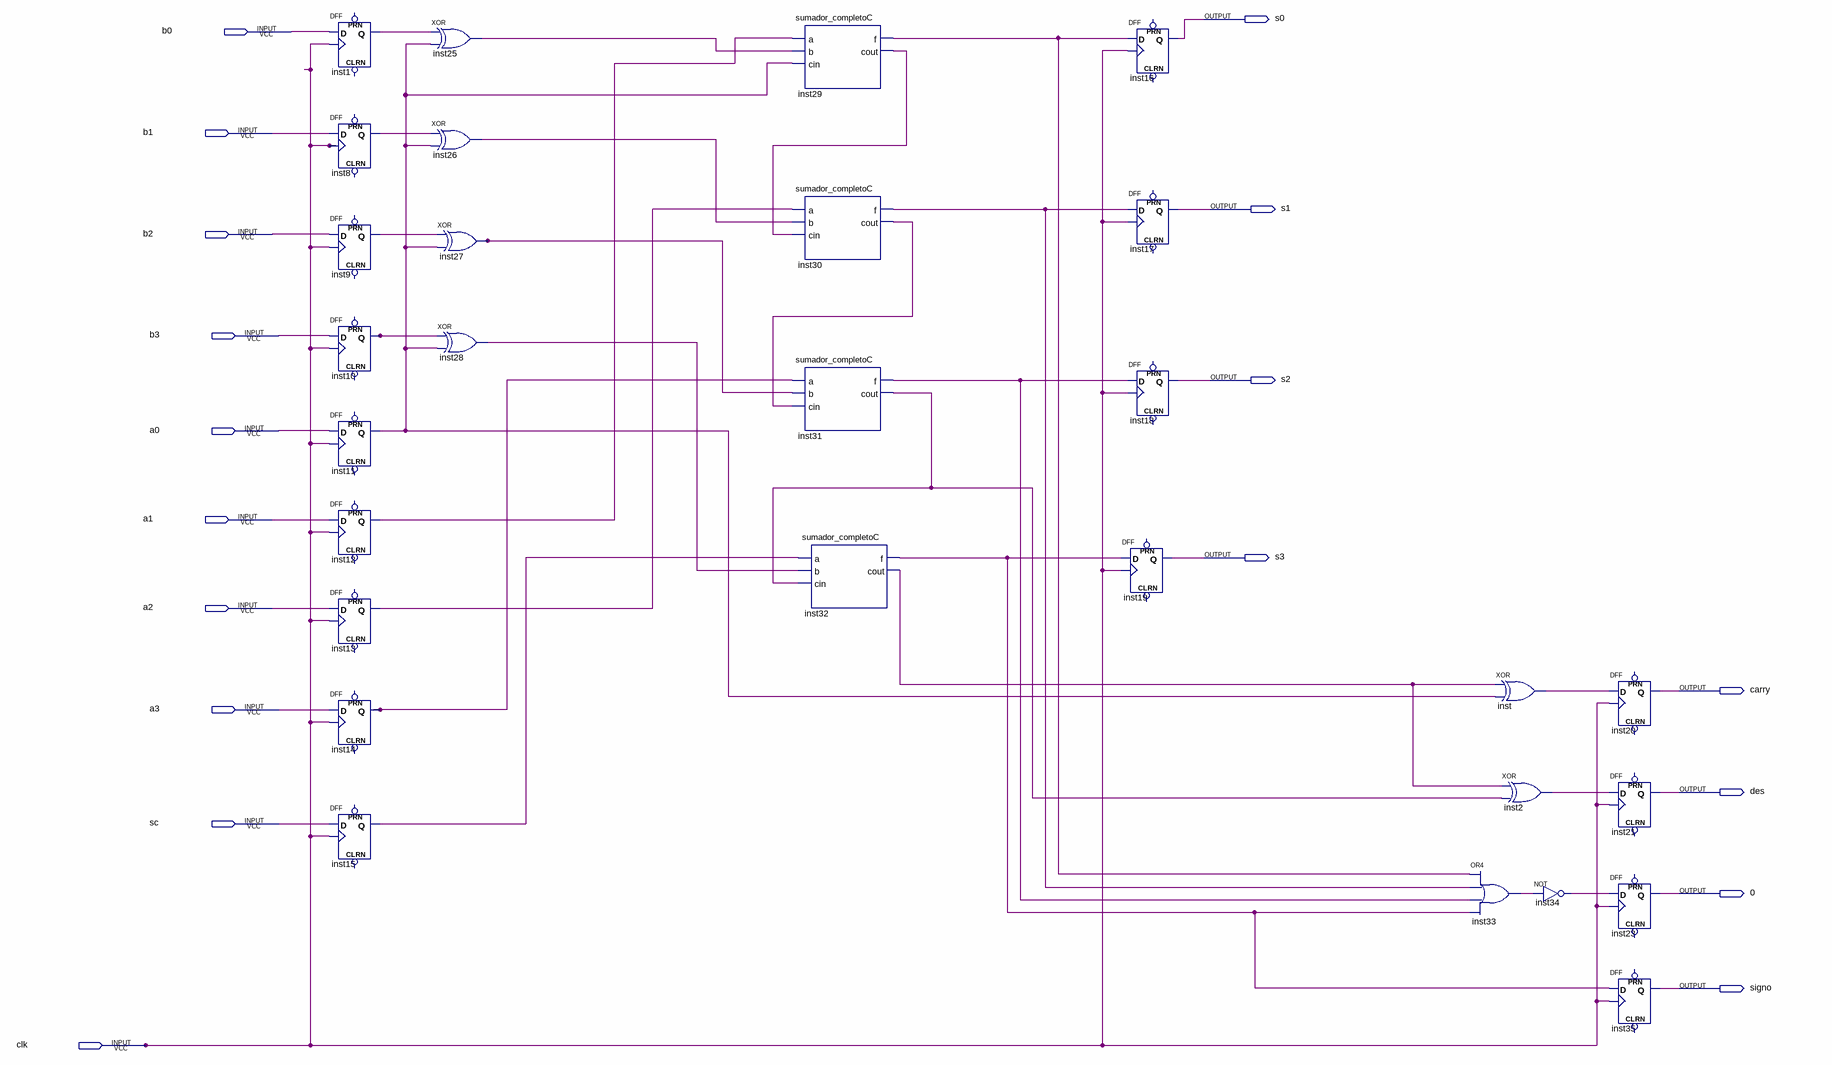
[diagram p0: schematic sheet]
// Quartus schematic sumador_completo.bdf as structural Verilog: 29 symbols, 18 pins
module sumador_completo (
  input  b0,
  input  b1,
  input  b2,
  input  b3,
  input  a0,
  input  a1,
  input  a2,
  input  a3,
  input  sc,
  input  clk,
  output s0,
  output s1,
  output s2,
  output s3,
  output carry,
  output des,
  output \0 ,
  output signo
);

  wire inst1_q, inst2_out, inst8_q, inst9_q, inst10_q, inst11_q, inst12_q, inst13_q, inst14_q, inst15_q,
       inst25_out, inst26_out, inst27_out, inst28_out, inst29_cout, inst29_f, inst30_cout, inst30_f,
       inst31_cout, inst31_f, inst32_cout, inst32_f, inst33_out, inst34_out, inst_out;

  DFF inst1 (.CLK(clk), .D(b0), .Q(inst1_q));  // open: CLRN, PRN
  DFF inst8 (.CLK(clk), .D(b1), .Q(inst8_q));  // open: CLRN, PRN
  DFF inst9 (.CLK(clk), .D(b2), .Q(inst9_q));  // open: CLRN, PRN
  DFF inst10 (.CLK(clk), .D(b3), .Q(inst10_q));  // open: CLRN, PRN
  DFF inst11 (.CLK(clk), .D(a0), .Q(inst11_q));  // open: CLRN, PRN
  DFF inst12 (.CLK(clk), .D(a1), .Q(inst12_q));  // open: CLRN, PRN
  DFF inst13 (.CLK(clk), .D(a2), .Q(inst13_q));  // open: CLRN, PRN
  DFF inst14 (.CLK(clk), .D(a3), .Q(inst14_q));  // open: CLRN, PRN
  DFF inst15 (.CLK(clk), .D(sc), .Q(inst15_q));  // open: CLRN, PRN
  xor inst25 (inst25_out, inst1_q, inst11_q);
  xor inst26 (inst26_out, inst8_q, inst11_q);
  xor inst27 (inst27_out, inst9_q, inst11_q);
  xor inst28 (inst28_out, inst10_q, inst11_q);
  sumador_completoC inst29 (.a(inst12_q), .b(inst25_out), .cin(inst11_q), .f(inst29_f), .cout(inst29_cout));
  sumador_completoC inst30 (.a(inst13_q), .b(inst26_out), .cin(inst29_cout), .f(inst30_f), .cout(inst30_cout));
  sumador_completoC inst31 (.a(inst14_q), .b(inst27_out), .cin(inst30_cout), .f(inst31_f), .cout(inst31_cout));
  sumador_completoC inst32 (.a(inst15_q), .b(inst28_out), .cin(inst31_cout), .f(inst32_f), .cout(inst32_cout));
  DFF inst16 (.CLK(clk), .D(inst29_f), .Q(s0));  // open: CLRN, PRN
  DFF inst17 (.CLK(clk), .D(inst30_f), .Q(s1));  // open: CLRN, PRN
  DFF inst18 (.CLK(clk), .D(inst31_f), .Q(s2));  // open: CLRN, PRN
  DFF inst19 (.CLK(clk), .D(inst32_f), .Q(s3));  // open: CLRN, PRN
  or inst33 (inst33_out, inst29_f, inst30_f, inst31_f, inst32_f);
  xor inst (inst_out, inst32_cout, inst11_q);
  xor inst2 (inst2_out, inst32_cout, inst31_cout);
  not inst34 (inst34_out, inst33_out);
  DFF inst20 (.CLK(clk), .D(inst_out), .Q(carry));  // open: CLRN, PRN
  DFF inst21 (.CLK(clk), .D(inst2_out), .Q(des));  // open: CLRN, PRN
  DFF inst23 (.CLK(clk), .D(inst34_out), .Q(\0 ));  // open: CLRN, PRN
  DFF inst35 (.CLK(clk), .D(inst32_f), .Q(signo));  // open: CLRN, PRN
endmodule
